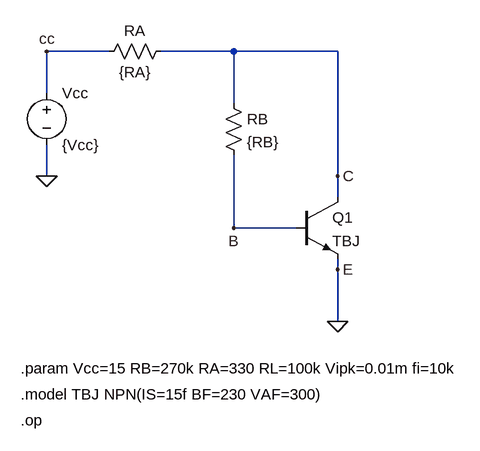
[diagram p0: schematic TBJ04CAop.asc]
TBJ04CAop.asc, the LTspice schematic file:
Version 4
SHEET 1 1608 1200
WIRE -64 -16 -160 -16
WIRE 128 -16 16 -16
WIRE 288 -16 128 -16
WIRE -160 48 -160 -16
WIRE 128 64 128 -16
WIRE -160 176 -160 128
WIRE 288 176 288 -16
WIRE 288 208 288 176
WIRE 128 256 128 144
WIRE 224 256 128 256
WIRE 288 320 288 304
WIRE 288 400 288 320
FLAG -160 176 0
FLAG 288 400 0
FLAG 128 256 B
FLAG 288 176 C
FLAG 288 320 E
FLAG -160 -16 cc
SYMBOL res 112 48 R0
SYMATTR InstName RB
SYMATTR Value {RB}
SYMBOL voltage -160 32 R0
WINDOW 123 0 0 Left 0
WINDOW 39 0 0 Left 0
SYMATTR InstName Vcc
SYMATTR Value {Vcc}
SYMBOL npn 224 208 R0
SYMATTR InstName Q1
SYMATTR Value TBJ
SYMBOL res 32 -32 R90
WINDOW 0 0 56 VBottom 2
WINDOW 3 32 56 VTop 2
SYMATTR InstName RA
SYMATTR Value {RA}
TEXT -200 472 Left 2 !.param Vcc=15 RB=270k RA=330 RL=100k Vipk=0.01m fi=10k
TEXT -200 512 Left 2 !.model TBJ NPN(IS=15f BF=230 VAF=300)
TEXT -200 552 Left 2 !.op

The netlist it stands for:
* TBJ04CAop.asc
RB C B {RB}
Vcc cc 0 {Vcc}
Q1 C B 0 0 TBJ
RA C cc {RA}
.model NPN NPN
.model PNP PNP
.lib standard.bjt
.param Vcc=15 RB=270k RA=330 RL=100k Vipk=0.01m fi=10k
.model TBJ NPN(IS=15f BF=230 VAF=300)
.op
.backanno
.end